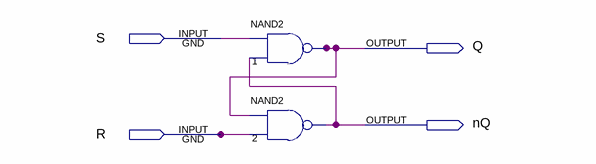
[diagram p0: schematic sheet]
// Quartus schematic r_s2.bdf as structural Verilog: 2 symbols, 4 pins
module r_s2 (
  input  S,
  input  R,
  output Q,
  output nQ
);

  nand u_1 (Q, S, nQ);
  nand u_2 (nQ, Q, R);
endmodule
